# Altium schematic sheet P0_MASTER.SchDoc
size C
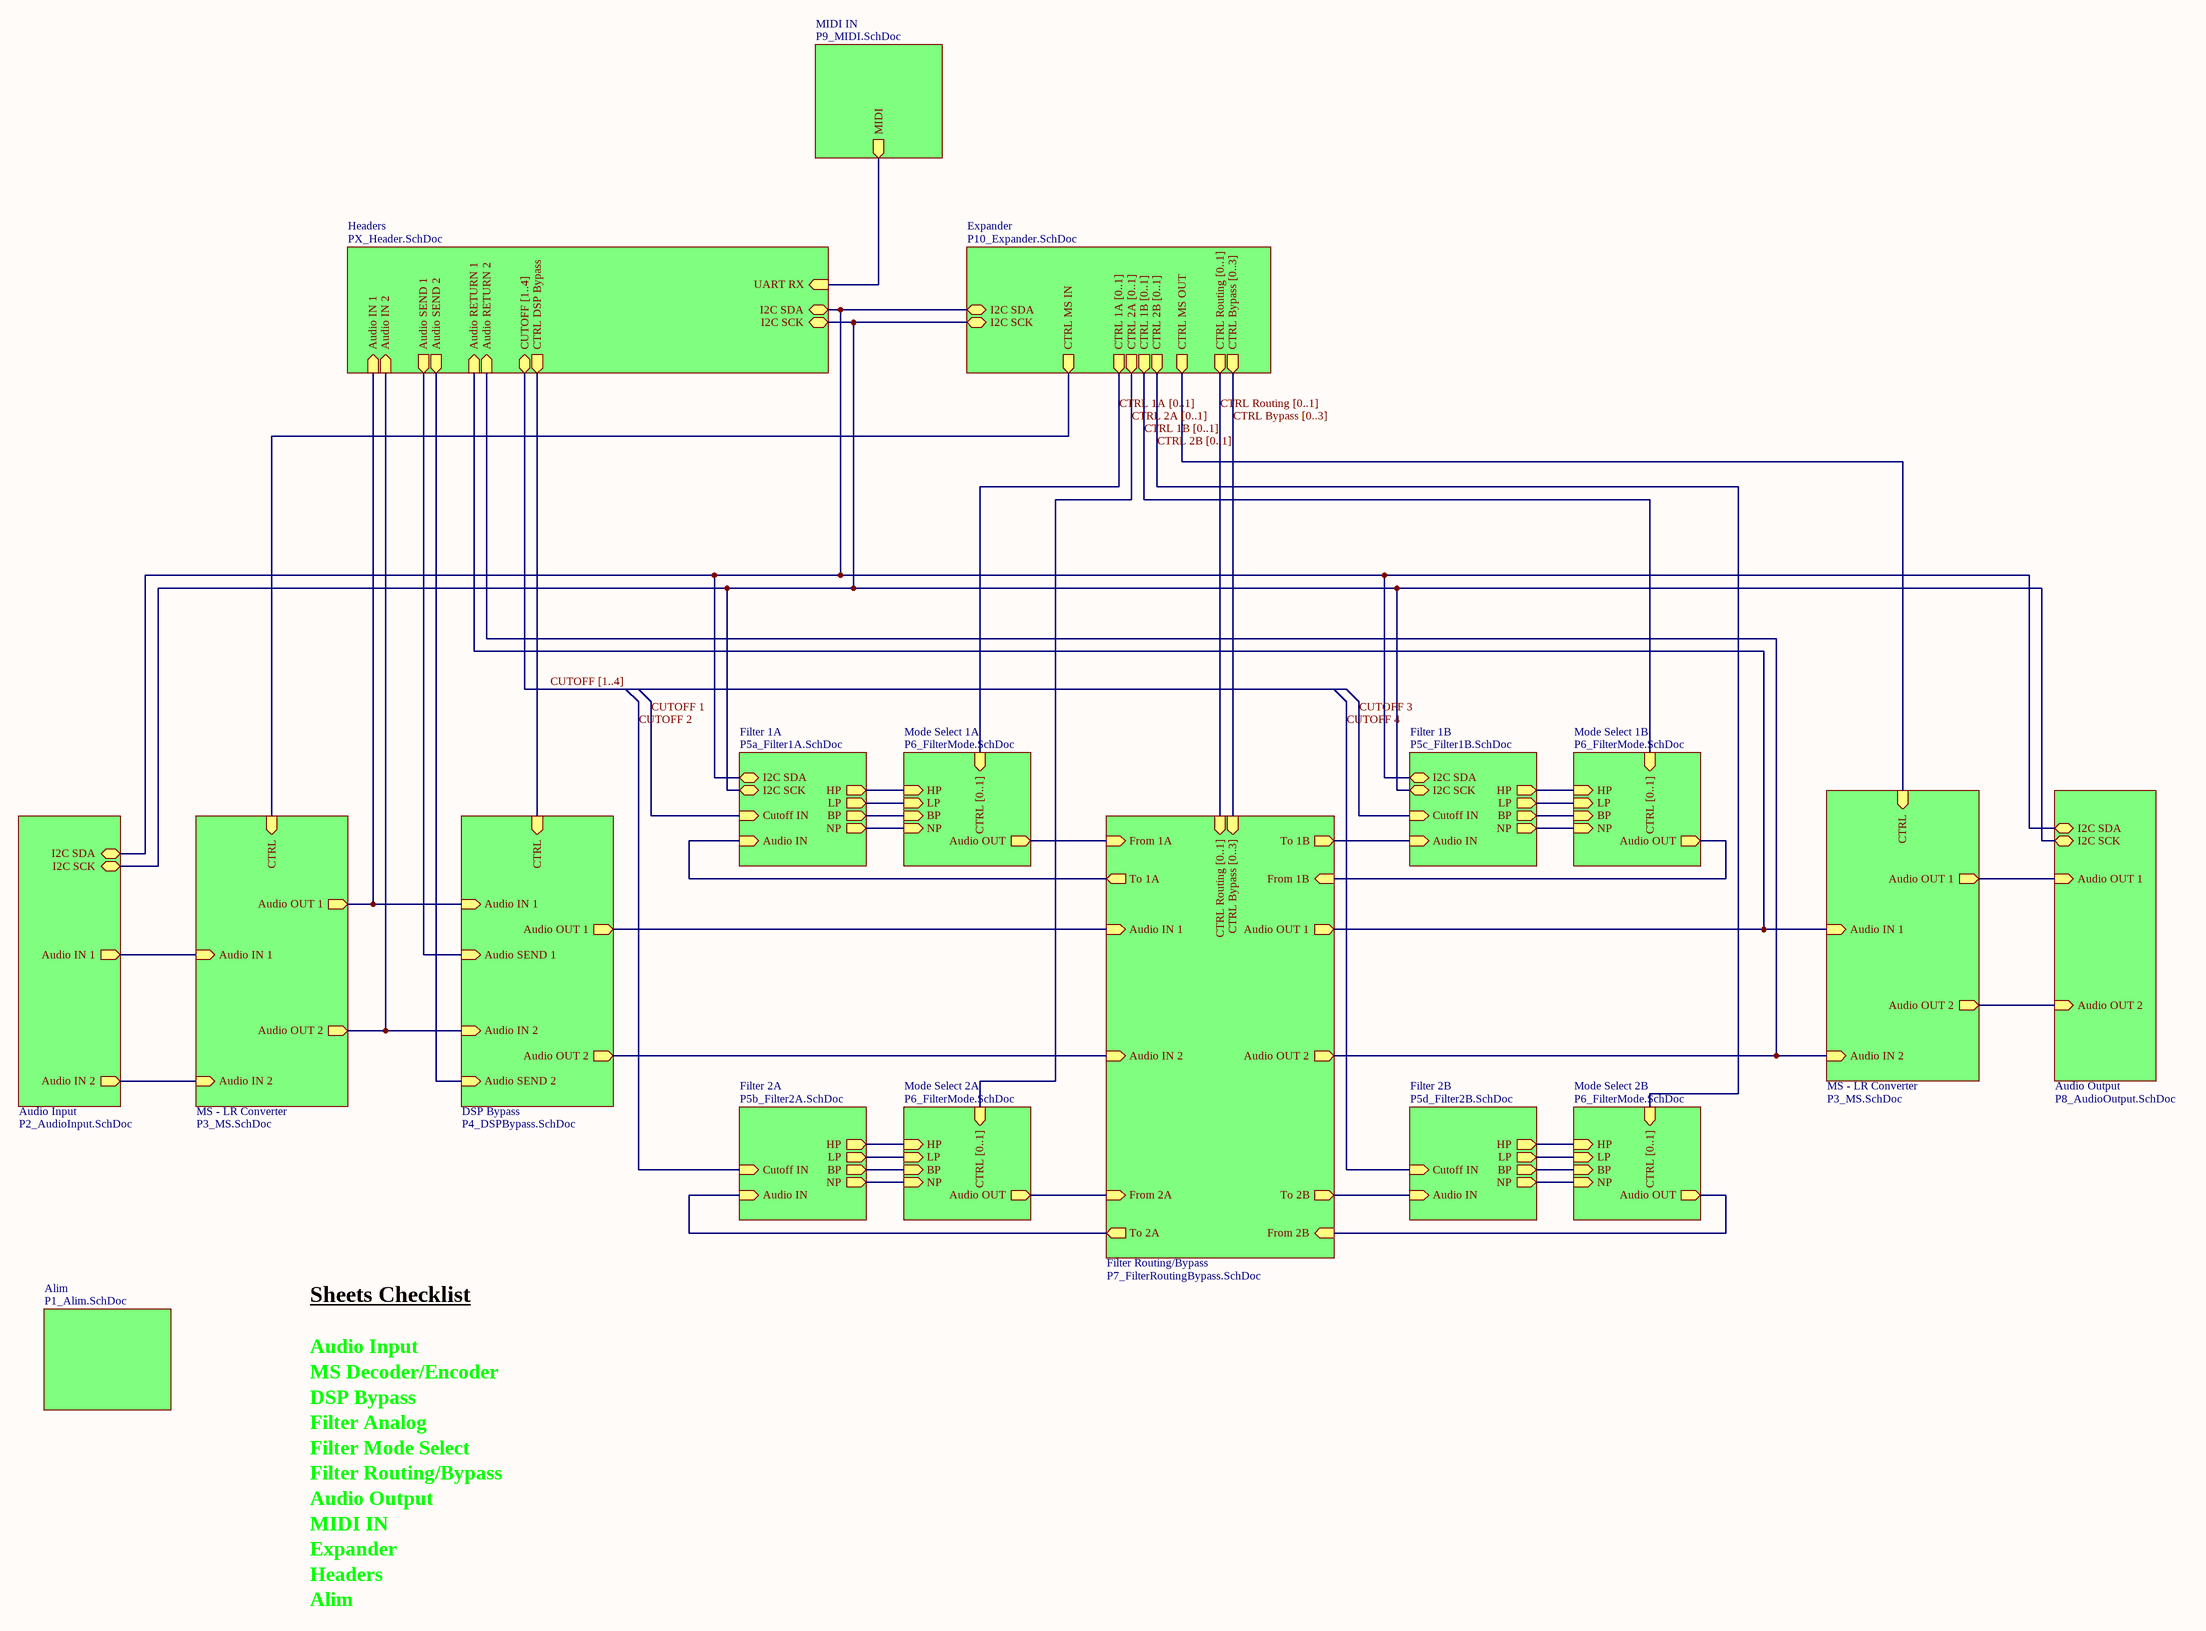
[diagram p0: P0_MASTER.SchDoc]

## Sub-sheets
Alim = P1_Alim.SchDoc: no entries
Audio Input = P2_AudioInput.SchDoc: Audio IN 1 (out), I2C SCK, I2C SDA, Audio IN 2 (out)
Audio Output = P8_AudioOutput.SchDoc: Audio OUT 1 (in), I2C SCK, I2C SDA, Audio OUT 2 (in)
DSP Bypass = P4_DSPBypass.SchDoc: Audio SEND 1 (in), Audio SEND 2 (in), Audio IN 1 (in), Audio IN 2 (in), Audio OUT 1 (out), Audio OUT 2 (out), CTRL (in)
Expander = P10_Expander.SchDoc: I2C SCK, I2C SDA, CTRL MS IN (out), CTRL 1A [0..1] (out), CTRL 2A [0..1] (out), CTRL 1B [0..1] (out), CTRL 2B [0..1] (out), CTRL MS OUT (out), CTRL Routing [0..1] (out), CTRL Bypass [0..3] (out)
Filter 1A = P5a_Filter1A.SchDoc: HP (out), LP (out), BP (out), NP (out), Audio IN (in), I2C SCK, I2C SDA, Cutoff IN (in)
Filter 1B = P5c_Filter1B.SchDoc: HP (out), LP (out), BP (out), NP (out), Audio IN (in), I2C SCK, I2C SDA, Cutoff IN (in)
Filter 2A = P5b_Filter2A.SchDoc: HP (out), LP (out), BP (out), NP (out), Audio IN (in), Cutoff IN (in)
Filter 2B = P5d_Filter2B.SchDoc: HP (out), LP (out), BP (out), NP (out), Audio IN (in), Cutoff IN (in)
Filter Routing/Bypass = P7_FilterRoutingBypass.SchDoc: From 1A (in), From 2A (in), To 2A (out), To 1A (out), Audio IN 1 (in), Audio IN 2 (in), Audio OUT 1 (out), Audio OUT 2 (out), To 1B (out), From 1B (in), To 2B (out), From 2B (in), CTRL Routing [0..1] (in), CTRL Bypass [0..3] (in)
Headers = PX_Header.SchDoc: Audio IN 1 (in), Audio IN 2 (in), Audio SEND 1 (out), Audio SEND 2 (out), Audio RETURN 1 (in), Audio RETURN 2 (in), I2C SCK, I2C SDA, CUTOFF [1..4], UART RX (in), CTRL DSP Bypass (out)
MIDI IN = P9_MIDI.SchDoc: MIDI (out)
Mode Select 1A = P6_FilterMode.SchDoc: HP (in), LP (in), BP (in), NP (in), Audio OUT (out), CTRL [0..1] (in)
Mode Select 1B = P6_FilterMode.SchDoc: HP (in), LP (in), BP (in), NP (in), Audio OUT (out), CTRL [0..1] (in)
Mode Select 2A = P6_FilterMode.SchDoc: HP (in), LP (in), BP (in), NP (in), Audio OUT (out), CTRL [0..1] (in)
Mode Select 2B = P6_FilterMode.SchDoc: HP (in), LP (in), BP (in), NP (in), Audio OUT (out), CTRL [0..1] (in)
MS - LR Converter = P3_MS.SchDoc: Audio IN 1 (in), Audio IN 2 (in), Audio OUT 1 (out), Audio OUT 2 (out), CTRL (in)
MS - LR Converter = P3_MS.SchDoc: Audio IN 1 (in), Audio IN 2 (in), Audio OUT 1 (out), Audio OUT 2 (out), CTRL (in)

## Nets
CUTOFF 1: sheet Filter 1A/Cutoff IN
CUTOFF 2: sheet Filter 2A/Cutoff IN
CUTOFF 3: sheet Filter 1B/Cutoff IN
CUTOFF 4: sheet Filter 2B/Cutoff IN
(unnamed): sheet Audio Input/Audio IN 1, sheet MS - LR Converter/Audio IN 1
(unnamed): sheet Audio Input/I2C SCK, sheet Headers/I2C SCK, sheet Filter 1A/I2C SCK, sheet Filter 1B/I2C SCK, sheet Audio Output/I2C SCK, sheet Expander/I2C SCK
(unnamed): sheet Audio Input/I2C SDA, sheet Headers/I2C SDA, sheet Filter 1A/I2C SDA, sheet Filter 1B/I2C SDA, sheet Audio Output/I2C SDA, sheet Expander/I2C SDA
(unnamed): sheet Audio Input/Audio IN 2, sheet MS - LR Converter/Audio IN 2
(unnamed): sheet Headers/Audio IN 1, sheet DSP Bypass/Audio IN 1, sheet MS - LR Converter/Audio OUT 1
(unnamed): sheet Headers/Audio IN 2, sheet DSP Bypass/Audio IN 2, sheet MS - LR Converter/Audio OUT 2
(unnamed): sheet Headers/Audio SEND 1, sheet DSP Bypass/Audio SEND 1
(unnamed): sheet Headers/Audio SEND 2, sheet DSP Bypass/Audio SEND 2
(unnamed): sheet Headers/Audio RETURN 1, sheet Filter Routing/Bypass/Audio OUT 1, sheet MS - LR Converter/Audio IN 1
(unnamed): sheet Headers/Audio RETURN 2, sheet Filter Routing/Bypass/Audio OUT 2, sheet MS - LR Converter/Audio IN 2
(unnamed): sheet Headers/UART RX, sheet MIDI IN/MIDI
(unnamed): sheet Headers/CTRL DSP Bypass, sheet DSP Bypass/CTRL
(unnamed): sheet DSP Bypass/Audio OUT 1, sheet Filter Routing/Bypass/Audio IN 1
(unnamed): sheet DSP Bypass/Audio OUT 2, sheet Filter Routing/Bypass/Audio IN 2
(unnamed): sheet MS - LR Converter/CTRL, sheet Expander/CTRL MS IN
(unnamed): sheet Filter 1A/HP, sheet Mode Select 1A/HP
(unnamed): sheet Filter 1A/LP, sheet Mode Select 1A/LP
(unnamed): sheet Filter 1A/BP, sheet Mode Select 1A/BP
(unnamed): sheet Filter 1A/NP, sheet Mode Select 1A/NP
(unnamed): sheet Filter 1A/Audio IN, sheet Filter Routing/Bypass/To 1A
(unnamed): sheet Mode Select 1A/Audio OUT, sheet Filter Routing/Bypass/From 1A
(unnamed): sheet Filter 2A/HP, sheet Mode Select 2A/HP
(unnamed): sheet Filter 2A/LP, sheet Mode Select 2A/LP
(unnamed): sheet Filter 2A/BP, sheet Mode Select 2A/BP
(unnamed): sheet Filter 2A/NP, sheet Mode Select 2A/NP
(unnamed): sheet Filter 2A/Audio IN, sheet Filter Routing/Bypass/To 2A
(unnamed): sheet Mode Select 2A/Audio OUT, sheet Filter Routing/Bypass/From 2A
(unnamed): sheet Filter Routing/Bypass/To 1B, sheet Filter 1B/Audio IN
(unnamed): sheet Filter Routing/Bypass/From 1B, sheet Mode Select 1B/Audio OUT
(unnamed): sheet Filter Routing/Bypass/To 2B, sheet Filter 2B/Audio IN
(unnamed): sheet Filter Routing/Bypass/From 2B, sheet Mode Select 2B/Audio OUT
(unnamed): sheet Filter 1B/HP, sheet Mode Select 1B/HP
(unnamed): sheet Filter 1B/LP, sheet Mode Select 1B/LP
(unnamed): sheet Filter 1B/BP, sheet Mode Select 1B/BP
(unnamed): sheet Filter 1B/NP, sheet Mode Select 1B/NP
(unnamed): sheet Filter 2B/HP, sheet Mode Select 2B/HP
(unnamed): sheet Filter 2B/LP, sheet Mode Select 2B/LP
(unnamed): sheet Filter 2B/BP, sheet Mode Select 2B/BP
(unnamed): sheet Filter 2B/NP, sheet Mode Select 2B/NP
(unnamed): sheet MS - LR Converter/Audio OUT 1, sheet Audio Output/Audio OUT 1
(unnamed): sheet MS - LR Converter/Audio OUT 2, sheet Audio Output/Audio OUT 2
(unnamed): sheet MS - LR Converter/CTRL, sheet Expander/CTRL MS OUT

## Buses and harness runs
bus CTRL 1A [0..1] = sheet Expander/CTRL 1A [0..1] = sheet Mode Select 1A/CTRL [0..1]
bus CTRL 1B [0..1] = sheet Expander/CTRL 1B [0..1] = sheet Mode Select 1B/CTRL [0..1]
bus CTRL 2A [0..1] = sheet Expander/CTRL 2A [0..1] = sheet Mode Select 2A/CTRL [0..1]
bus CTRL 2B [0..1] = sheet Expander/CTRL 2B [0..1] = sheet Mode Select 2B/CTRL [0..1]
bus CTRL Bypass [0..3] = sheet Expander/CTRL Bypass [0..3] = sheet Filter Routing/Bypass/CTRL Bypass [0..3]
bus CTRL Routing [0..1] = sheet Expander/CTRL Routing [0..1] = sheet Filter Routing/Bypass/CTRL Routing [0..1]
bus CUTOFF [1..4] = sheet Headers/CUTOFF [1..4]

## Notes on the sheet
- Sheets Checklist
- Audio Input
- MS Decoder/Encoder
- DSP Bypass
- Filter Analog
- Filter Mode Select
- Filter Routing/Bypass
- Audio Output
- MIDI IN
- Expander
- Headers
- Alim